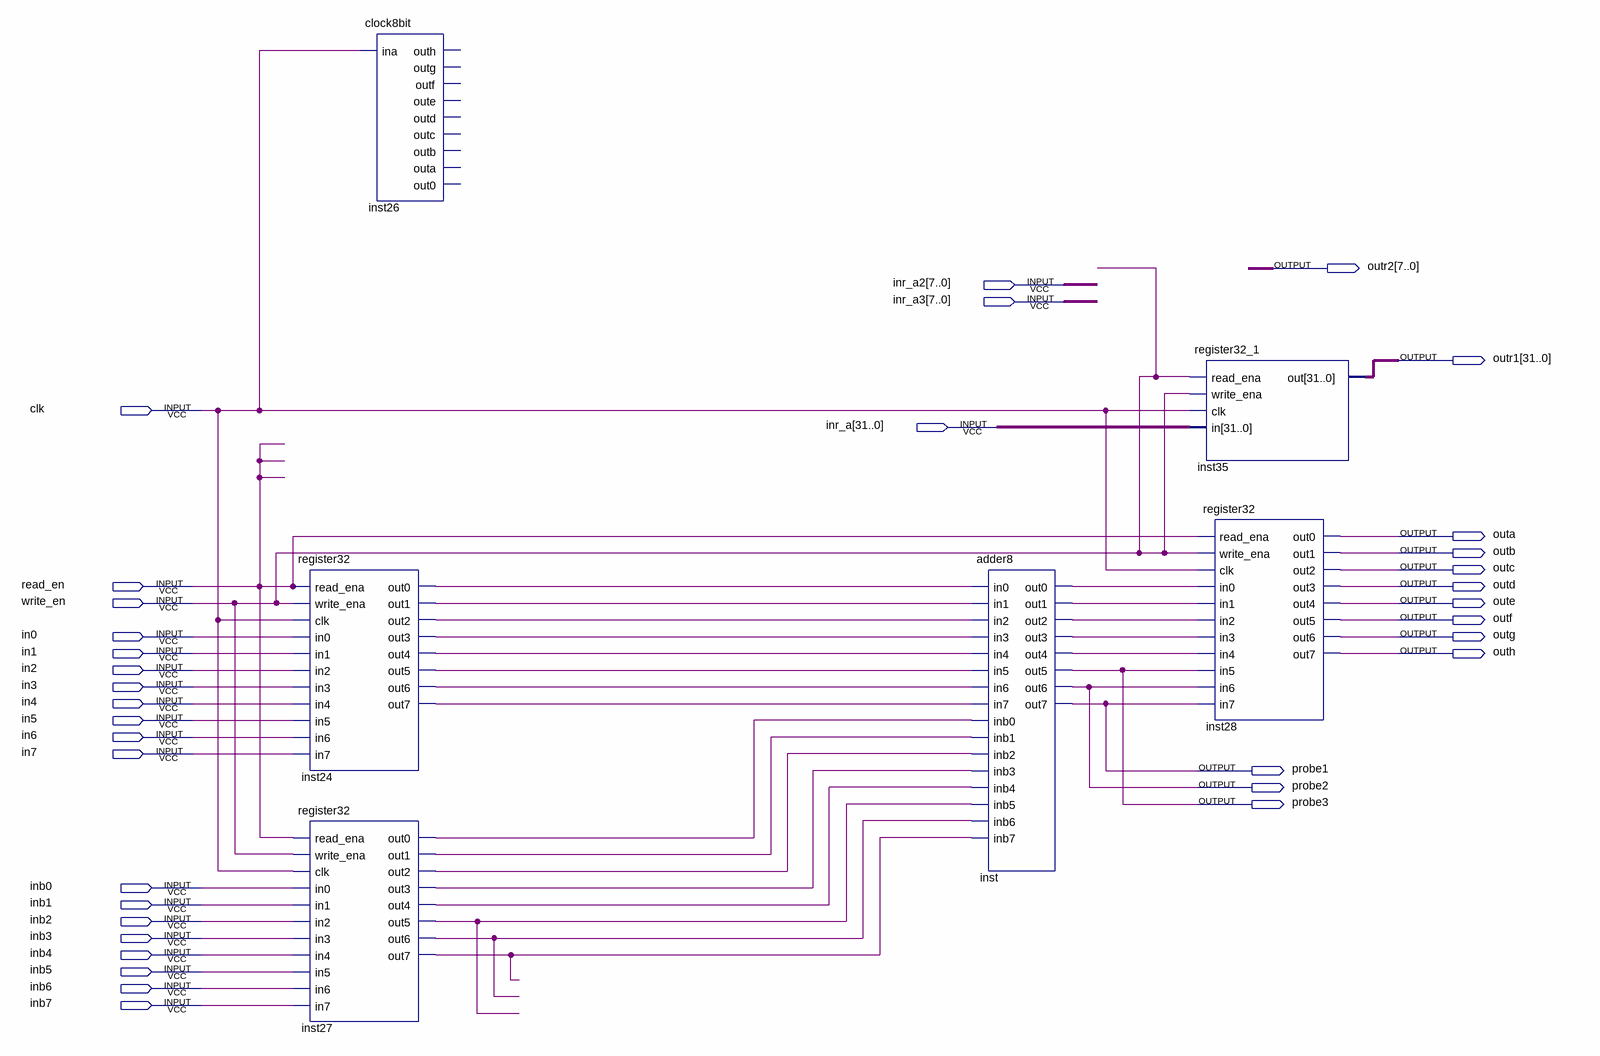
[diagram p0: schematic sheet]
// Quartus schematic clock.bdf as structural Verilog: 6 symbols, 35 pins
module clock (
  input  [7:0] inr_a2,
  input  [7:0] inr_a3,
  input  clk,
  input  [31:0] inr_a,
  input  read_en,
  input  write_en,
  input  in0,
  input  in1,
  input  in2,
  input  in3,
  input  in4,
  input  in5,
  input  in6,
  input  in7,
  input  inb0,
  input  inb1,
  input  inb2,
  input  inb3,
  input  inb4,
  input  inb5,
  input  inb6,
  input  inb7,
  output [7:0] outr2,
  output [31:0] outr1,
  output outa,
  output outb,
  output outc,
  output outd,
  output oute,
  output outf,
  output outg,
  output outh,
  output probe1,
  output probe2,
  output probe3
);

  wire inst24_out0, inst24_out1, inst24_out2, inst24_out3, inst24_out4, inst24_out5, inst24_out6,
       inst24_out7, inst27_out0, inst27_out1, inst27_out2, inst27_out3, inst27_out4, inst27_out5,
       inst27_out6, inst27_out7, inst_out0, inst_out1, inst_out2, inst_out3, inst_out4;

  register32 inst24 (
    .read_ena(read_en), .write_ena(write_en), .clk(clk), .in0(in0), .in1(in1), .in2(in2), .in3(in3),
    .in4(in4), .in5(in5), .in6(in6), .in7(in7), .out0(inst24_out0), .out1(inst24_out1), .out2(inst24_out2),
    .out3(inst24_out3), .out4(inst24_out4), .out5(inst24_out5), .out6(inst24_out6), .out7(inst24_out7));
  register32 inst27 (
    .read_ena(read_en), .write_ena(write_en), .clk(clk), .in0(inb0), .in1(inb1), .in2(inb2), .in3(inb3),
    .in4(inb4), .in5(inb5), .in6(inb6), .in7(inb7), .out0(inst27_out0), .out1(inst27_out1),
    .out2(inst27_out2), .out3(inst27_out3), .out4(inst27_out4), .out5(inst27_out5), .out6(inst27_out6),
    .out7(inst27_out7));
  clock8bit inst26 (.ina(clk));  // open: outh, outg, outf, oute, outd, outc, outb, outa, out0
  adder8 inst (
    .in0(inst24_out0), .in1(inst24_out1), .in2(inst24_out2), .in3(inst24_out3), .in4(inst24_out4),
    .in5(inst24_out5), .in6(inst24_out6), .in7(inst24_out7), .inb0(inst27_out0), .inb1(inst27_out1),
    .inb2(inst27_out2), .inb3(inst27_out3), .inb4(inst27_out4), .inb5(inst27_out5), .inb6(inst27_out6),
    .inb7(inst27_out7), .out0(inst_out0), .out1(inst_out1), .out2(inst_out2), .out3(inst_out3),
    .out4(inst_out4), .out5(probe3), .out6(probe2), .out7(probe1));
  register32_1 inst35 (.read_ena(write_en), .write_ena(write_en), .clk(clk), .in(inr_a), .out(outr1));
  register32 inst28 (
    .read_ena(read_en), .write_ena(write_en), .clk(clk), .in0(inst_out0), .in1(inst_out1), .in2(inst_out2),
    .in3(inst_out3), .in4(inst_out4), .in5(probe3), .in6(probe2), .in7(probe1), .out0(outa), .out1(outb),
    .out2(outc), .out3(outd), .out4(oute), .out5(outf), .out6(outg), .out7(outh));
endmodule
